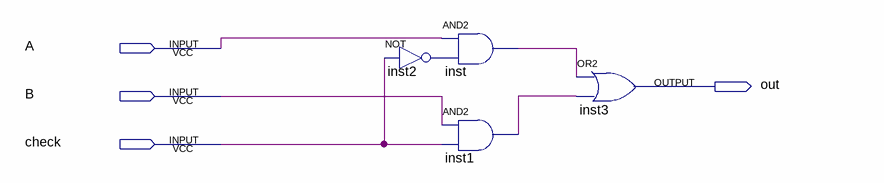
[diagram p0: schematic sheet]
// Quartus schematic mux21.bdf as structural Verilog: 4 symbols, 4 pins
module mux21 (
  input  A,
  input  B,
  input  check,
  output out
);

  wire inst1_out, inst2_out, inst_out;

  and inst (inst_out, A, inst2_out);
  not inst2 (inst2_out, check);
  and inst1 (inst1_out, B, check);
  or inst3 (out, inst_out, inst1_out);
endmodule
